# EAGLE schematic Diseño_Placa1_v1 (EAGLE 9.7.0)
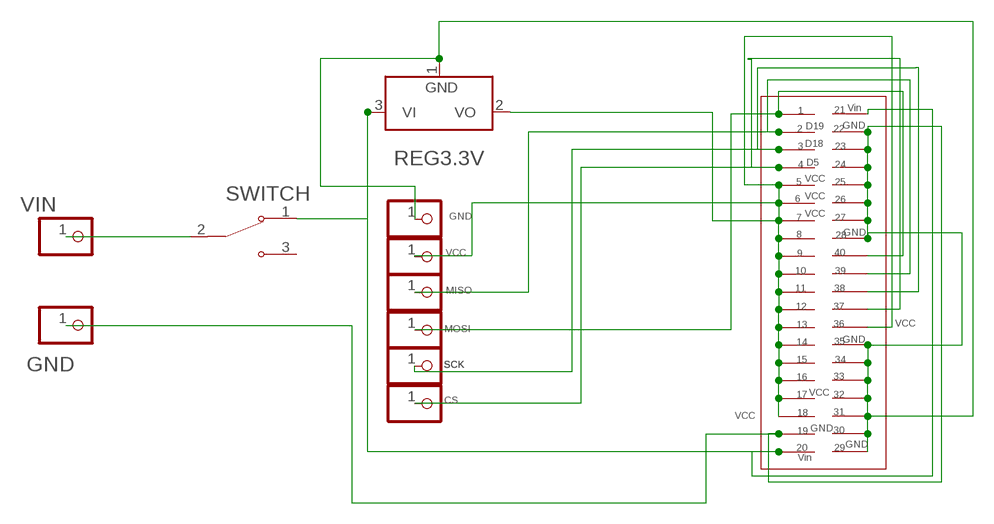
[diagram p0: schematic, sheet 1]

## Parts
GND  PINHD-1X1  [1X01]
JP1  GND  PINHD-1X1  [1X01]
JP2  VCC  PINHD-1X1  [1X01]
JP3  MISO  PINHD-1X1  [1X01]
JP4  MOSI  PINHD-1X1  [1X01]
JP5  SCK  PINHD-1X1  [1X01]
JP6  CS  PINHD-1X1  [1X01]
REG3.3V  LD1117_TO220  [TO220V]
SWITCH  MINI-SPDT-SW  [SW_MINI-SPDT-SW]
U$1  PINHEADER  [PINHEADER]
VIN  PINHD-1X1  [1X01]

## Nets
N$1: JP4.1 U$1.1 U$1.40
N$2: SWITCH.2 VIN.1
N$3: JP3.1 U$1.2 U$1.39
N$4: JP5.1 U$1.3 U$1.38
N$5: JP6.1 U$1.4 U$1.37
N$7: GND.1 JP1.1 REG3.3V.1(GND) U$1.19 U$1.22 U$1.23 U$1.24 U$1.25 U$1.26 U$1.27 U$1.28 U$1.29 U$1.30 U$1.31 U$1.32 U$1.33 U$1.34 U$1.35
N$8: REG3.3V.3(VI) SWITCH.1 U$1.20 U$1.21
N$9: JP2.1 REG3.3V.2(VO) U$1.5 U$1.6 U$1.7 U$1.8 U$1.9 U$1.10 U$1.11 U$1.12 U$1.13 U$1.14 U$1.15 U$1.16 U$1.17 U$1.18 U$1.36
Unconnected: SWITCH.3

## Notes on the sheet
- 1 | 21 | Vin
- D19 | GND
- 2 | 22
- D18
- 3 | 23
- 4 | D5 | 24
- VCC
- 5 | 25
- VCC
- 6 | 26
- VCC
- GND | 7 | 27
- 8 | 28 | GND
- VCC | 9 | 40
- 10 | 39
- MISO | 11 | 38
- 12 | 37
- 13 | 36 | VCC
- MOSI
- 35 | GND
- 14
- 15 | 34
- SCK | SCK
- 16 | 33
- 17 | VCC | 32
- CS
- 18 | 31
- VCC
- 19 | GND | 30
- GND
- 20 | 29
- Vin

## Library data of the parts
GND JP1-JP6 VIN = Connector:PINHD-1X1: PIN HEADER; CATEGORY: Headers; DESCRIPTION: Header, Straight, 1 Position; MANUFACTURER: Generic; MPN: Generic; OPERATING_TEMPERATURE: Generic; PART_STATUS: Active; PITCH: 0.100" (2.54mm); ROHS_COMPLIANCE: Generic; SERIES: Generic; SUB-CATEGORY: Headers, Male Pins; TYPE: Board to Board or Cable, Unshrouded, Through Hole, Straight
REG3.3V = IC_Power-Management:LD1117: Adjustable and fixed positive voltage regulator Reference Datasheet <https://www.st.com/content/ccc/resource/technical/document/datasheet/99/3b/7d/91/91/51/4b/be/CD00000544.pdf/files/CD00000544.pdf/jcr:content/translations/en.CD00000544.pdf>; CATEGORY: IC_Linear; DESCRIPTION: Adjustable voltage regulator; MANUFACTURER: STMicroelectronics; MPN: Generic; SERIES: LM1117; SUB-CATEGORY: Voltage Regulator; TYPE: Linear
SWITCH = MINI-SPDT-SW:MINI-SPDT-SW: Simple breadboard friendly SPDT slide switch. Rated at 30V/200mA with operating force of 250 +/-100gf. Check availability <https://pricing.snapeda.com/parts/MINI-SPDT-SW/Gravitech/view-part?ref=eda>; AVAILABILITY: In Stock; CHECK_PRICES: https://www.snapeda.com/parts/MINI-SPDT-SW/Gravitech/view-part/?ref=eda; DESCRIPTION: Slide Switches MINI SPDT SWITCH; MF: Gravitech; MP: MINI-SPDT-SW; PACKAGE: None; PRICE: None; SNAPEDA_LINK: https://www.snapeda.com/parts/MINI-SPDT-SW/Gravitech/view-part/?ref=snap
U$1 = PINHEADER-40:PINHEADER

## Module WF
Ports: 

### Library data of the parts